# Altium project Stlink v2.PrjPcb
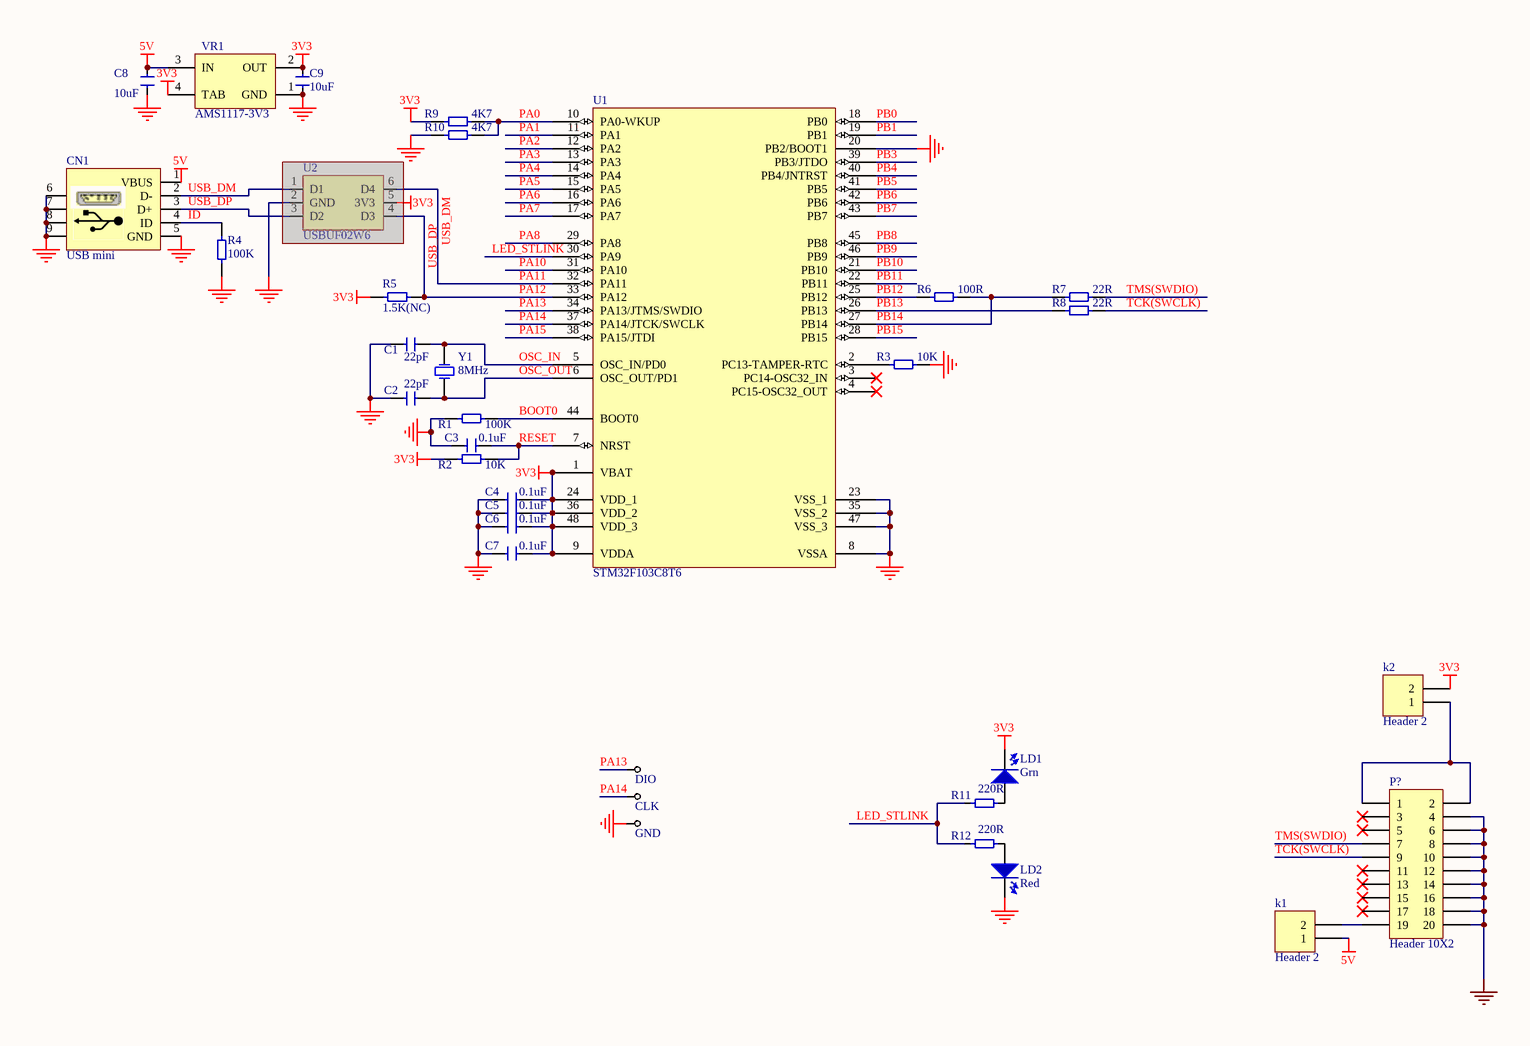
[diagram p0: Stlink v2.SchDoc]
1 sheet, 34 parts. Net scope: global (net labels, ports and power ports of the same name join across sheets).
Board file: Stlink v2.PcbDoc

## Sheet Stlink v2.SchDoc
size A3

### Parts
C1  Capacitor SMD  [SMD_CAP_1206]  (value not drawn)
C2  Capacitor SMD  [SMD_CAP_1206]  (value not drawn)
C3  Capacitor SMD  [SMD_CAP_1206]  (value not drawn)
C4  Capacitor SMD  [SMD_CAP_1206]  (value not drawn)
C5  Capacitor SMD  [SMD_CAP_1206]  (value not drawn)
C6  Capacitor SMD  [SMD_CAP_1206]  (value not drawn)
C7  Capacitor SMD  [SMD_CAP_1206]  (value not drawn)
C8  Capacitor SMD  [SMD_CAP_1206]  (value not drawn)
C9  Capacitor SMD  [SMD_CAP_1206]  (value not drawn)
CLK  Test Point  [Test Point Small]  (value not drawn)
CN1  USB mini  [USB/SM0.8-6H5]
DIO  Test Point  [Test Point Small]  (value not drawn)
GND  Test Point  [Test Point Small]  (value not drawn)
JTAG/SWD  Header 10X2  [HDR2X10]
k1  Header 2  [HDR1X2]
k2  Header 2  [HDR1X2]
LD1  Grn  [LED_0805 GRE]
LD2  Red  [LED_0805 GRE]
R1  Resistor SMD  [SMD_RES_1206]  (value not drawn)
R2  Resistor SMD  [SMD_RES_1206]  (value not drawn)
R3  Resistor SMD  [SMD_RES_1206]  (value not drawn)
R4  Resistor SMD  [SMD_RES_1206]  (value not drawn)
R5  Resistor SMD  [SMD_RES_1206]  (value not drawn)
R6  Resistor SMD  [SMD_RES_1206]  (value not drawn)
R7  Resistor SMD  [SMD_RES_1206]  (value not drawn)
R8  Resistor SMD  [SMD_RES_1206]  (value not drawn)
R9  Resistor SMD  [SMD_RES_1206]  (value not drawn)
R10  Resistor SMD  [SMD_RES_1206]  (value not drawn)
R11  Resistor SMD  [SMD_RES_1206]  (value not drawn)
R12  Resistor SMD  [SMD_RES_1206]  (value not drawn)
U1  STM32F103C8T6  [LQFP48_M]
U2  USBUF02W6  [SOT23-6]  (masked out: inside a compile mask, not in the netlist)
VR1  AMS1117-3V3  [MP04A_N]
Y1  8MHz  [XTAL]

### Nets
3V3: C4.2 C5.2 C6.2 C7.2 C9.2 k2.2 LD1.2(K) R2.1 R5.1 R9.1 U1.1(VBAT) U1.9(VDDA) U1.24(VDD_1) U1.36(VDD_2) U1.48(VDD_3) VR1.2(OUT) VR1.4(TAB)
5V: C8.2 CN1.1(VBUS) k1.1 VR1.3(IN)
GND: C1.1 C2.1 C3.1 C4.1 C5.1 C6.1 C7.1 C8.1 C9.1 CN1.5(GND) CN1.6 CN1.7 CN1.8 CN1.9 GND.1(T) JTAG/SWD.4 JTAG/SWD.6 JTAG/SWD.8 JTAG/SWD.10 JTAG/SWD.12 JTAG/SWD.14 JTAG/SWD.16 JTAG/SWD.18 JTAG/SWD.20 LD2.2(K) R1.1 R3.2 R4.1 R10.1 U1.8(VSSA) U1.20(PB2/BOOT1) U1.23(VSS_1) U1.35(VSS_2) U1.47(VSS_3) VR1.1(GND)
BOOT0: R1.2 U1.44(BOOT0)
ID: CN1.4(ID) R4.2
LED_STLINK: R11.1 R12.1 U1.30(PA9)
OSC_IN: C1.2 U1.5(OSC_IN/PD0) Y1.1(OSC1)
OSC_OUT: C2.2 U1.6(OSC_OUT/PD1) Y1.2(OSC2)
PA0: R9.2 R10.2 U1.10(PA0-WKUP)
PA1: U1.11(PA1)
PA2: U1.12(PA2)
PA3: U1.13(PA3)
PA4: U1.14(PA4)
PA5: U1.15(PA5)
PA6: U1.16(PA6)
PA7: U1.17(PA7)
PA8: U1.29(PA8)
PA10: U1.31(PA10)
PA11: CN1.2(D-) U1.32(PA11)  [also labelled USB_DM]
PA12: CN1.3(D+) R5.2 U1.33(PA12)  [also labelled USB_DP]
PA13: DIO.1(T) U1.34(PA13/JTMS/SWDIO)
PA14: CLK.1(T) U1.37(PA14/JTCK/SWCLK)
PA15: U1.38(PA15/JTDI)
PB0: U1.18(PB0)
PB1: U1.19(PB1)
PB3: U1.39(PB3/JTDO)
PB4: U1.40(PB4/JNTRST)
PB5: U1.41(PB5)
PB6: U1.42(PB6)
PB7: U1.43(PB7)
PB8: U1.45(PB8)
PB9: U1.46(PB9)
PB10: U1.21(PB10)
PB11: U1.22(PB11)
PB12: R6.1 U1.25(PB12)
PB13: R8.1 U1.26(PB13)
PB14: R6.2 R7.1 U1.27(PB14)
PB15: U1.28(PB15)
RESET: C3.2 R2.2 U1.7(NRST)
TCK(SWCLK): JTAG/SWD.9 R8.2
TMS(SWDIO): JTAG/SWD.7 R7.2
NetJTAG/SWD_1: JTAG/SWD.1 JTAG/SWD.2 k2.1
NetJTAG/SWD_19: JTAG/SWD.19 k1.2
NetLD1_1: LD1.1(A) R11.2
NetLD2_1: LD2.1(A) R12.2
NetR3_1: R3.1 U1.2(PC13-TAMPER-RTC)

Not connected (* = marked no-connect by the designer): JTAG/SWD 3* 5* 11* 13* 15* 17*; U1 3(PC14-OSC32_IN)* 4(PC15-OSC32_OUT)*

### Notes on the sheet
- (in symbol Capacitor SMD) 22pF; 0.1uF; 10uF
- (in symbol Resistor SMD) 10K; 100K; 1.5K(NC); 100R; 22R; 4K7; 220R

### Library data of the parts
CN1 = USB mini: mini USB Connector
JTAG/SWD = Header 10X2: Header, 10-Pin, Dual row
k1 k2 = Header 2: Header, 2-Pin; LatestRevisionDate: 17-Jul-2002; LatestRevisionNote: Re-released for DXP Platform.; Publisher: Altium Limited
LD1 LD2 = LED SMD
U1 = STM32F103C8T6: STM32 ARM-based 32-bit MCU with 64 Kbytes Flash, 48-pin LQFP, Industrial Temperature; Published: 30-May-2008; DatasheetVersion: rev6, Mar-2008; PackageVersion: Mar-2008; PackageReference: LQFP48; Publisher: Altium Limited; PackageDescription: 48-Pin Low-Profile Quad Flat Pack, 7 x 7 mm Body, 0.5 mm Pitch (LQFP48); ComponentLink1Description: Manufacturer Link; ComponentLink1URL: www.st.com/stm32; ComponentLink2Description: Datasheet; ComponentLink2URL: http://www.st.com/stonline/products/literature/ds/13587.pdf
U2 = USBUFxxW6
VR1 = LM1117IMP-x.x: x.x Volt, 800mA Low-Dropout Linear Regulator, 4-pin SOT-223; PartNumber: LM1117IMP-3.3; Manufacturer: National Semiconductor; PackageTopMarking: XYTT*N05B; PowerWise: N; CompType: LDO IC; Published: 4-Dec-2008; DatasheetVersion: Apr-2006; PackageVersion: revB, Apr-2003; PackageReference: MP04A; Publisher: Altium Limited; PackageDescription: Molded SOT-223, 6.50 x 3.56 x 1.6mm Body, 4 Lead, 2.3mm Pitch; Supplier 1: Farnell; Supplier Part Number 1: 7614123; RoHS: N; PinCount: 4; Code_JEDEC: TO-261-AA; Code_IPC: SOT223-4; ComponentLink1Description: LM1117 Datasheet; ComponentLink1URL: http://www.national.com/ds/LM/LM1117.pdf; ComponentLink2Description: LM1117 Web Page; ComponentLink2URL: http://www.national.com/pf/LM/LM1117.html; ComponentLink3Description: MP04A Package Page; ComponentLink3URL: http://www.national.com/packaging/folders/mp04a.html
Y1 = XTAL: XTAL Crystal; Company: E.P.I.L; Design Date: 11/04/2011; Value: 8MHz